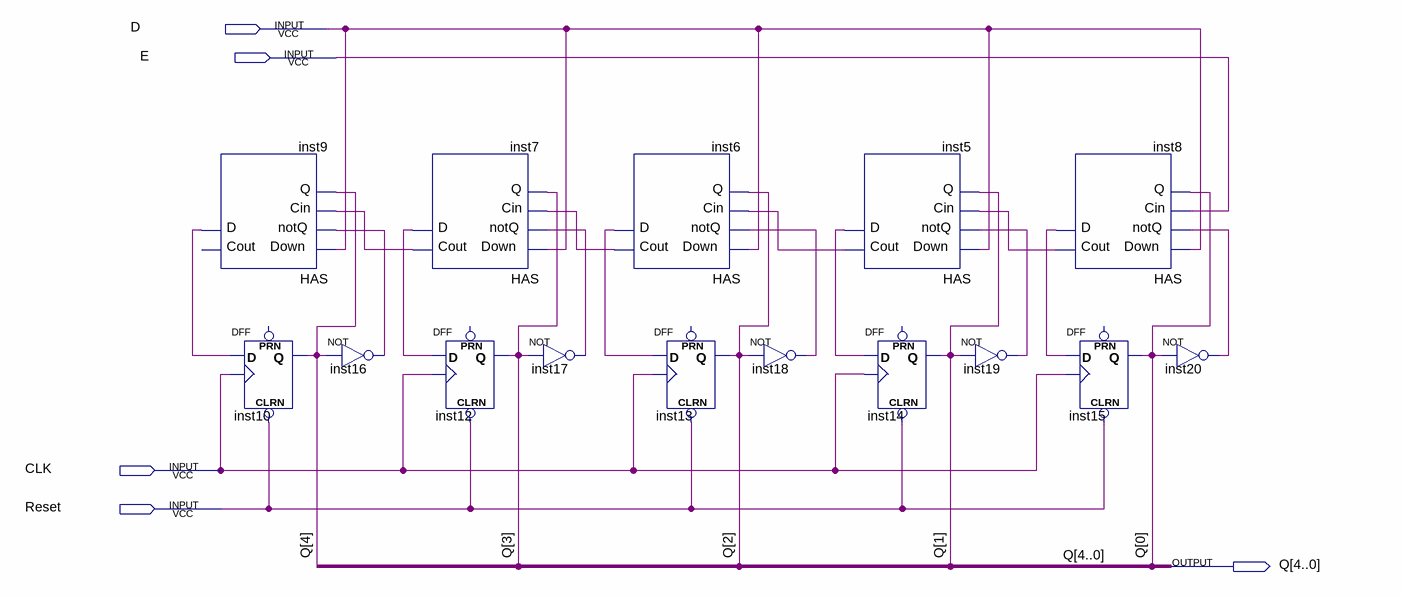
[diagram p0: schematic sheet]
// Quartus schematic TOP.bdf as structural Verilog: 15 symbols, 5 pins
module TOP (
  input  D,
  input  E,
  input  CLK,
  input  Reset,
  output [4:0] Q
);

  wire inst5_cout, inst5_d, inst6_cout, inst6_d, inst7_cout, inst7_d, inst8_cout, inst8_d, inst9_d,
       inst16_out, inst17_out, inst18_out, inst19_out, inst20_out;

  HAS inst9 (.Down(D), .notQ(inst16_out), .Cin(inst7_cout), .Q(Q[4]), .D(inst9_d));  // open: Cout
  DFF inst10 (.CLRN(Reset), .CLK(CLK), .D(inst9_d), .Q(Q[4]));  // open: PRN
  not inst16 (inst16_out, Q[4]);
  HAS inst7 (.Down(D), .notQ(inst17_out), .Cin(inst6_cout), .Q(Q[3]), .Cout(inst7_cout), .D(inst7_d));
  DFF inst12 (.CLRN(Reset), .CLK(CLK), .D(inst7_d), .Q(Q[3]));  // open: PRN
  not inst17 (inst17_out, Q[3]);
  HAS inst6 (.Down(D), .notQ(inst18_out), .Cin(inst5_cout), .Q(Q[2]), .Cout(inst6_cout), .D(inst6_d));
  DFF inst13 (.CLRN(Reset), .CLK(CLK), .D(inst6_d), .Q(Q[2]));  // open: PRN
  not inst18 (inst18_out, Q[2]);
  HAS inst5 (.Down(D), .notQ(inst19_out), .Cin(inst8_cout), .Q(Q[1]), .Cout(inst5_cout), .D(inst5_d));
  DFF inst14 (.CLRN(Reset), .CLK(CLK), .D(inst5_d), .Q(Q[1]));  // open: PRN
  not inst19 (inst19_out, Q[1]);
  HAS inst8 (.Down(D), .notQ(inst20_out), .Cin(E), .Q(Q[0]), .Cout(inst8_cout), .D(inst8_d));
  DFF inst15 (.CLRN(Reset), .CLK(CLK), .D(inst8_d), .Q(Q[0]));  // open: PRN
  not inst20 (inst20_out, Q[0]);
endmodule
